# Altium schematic sheet BATTERY_GESTION.SchDoc: DARKYDEN_BATTERY_GESTION (part 3 of 3)
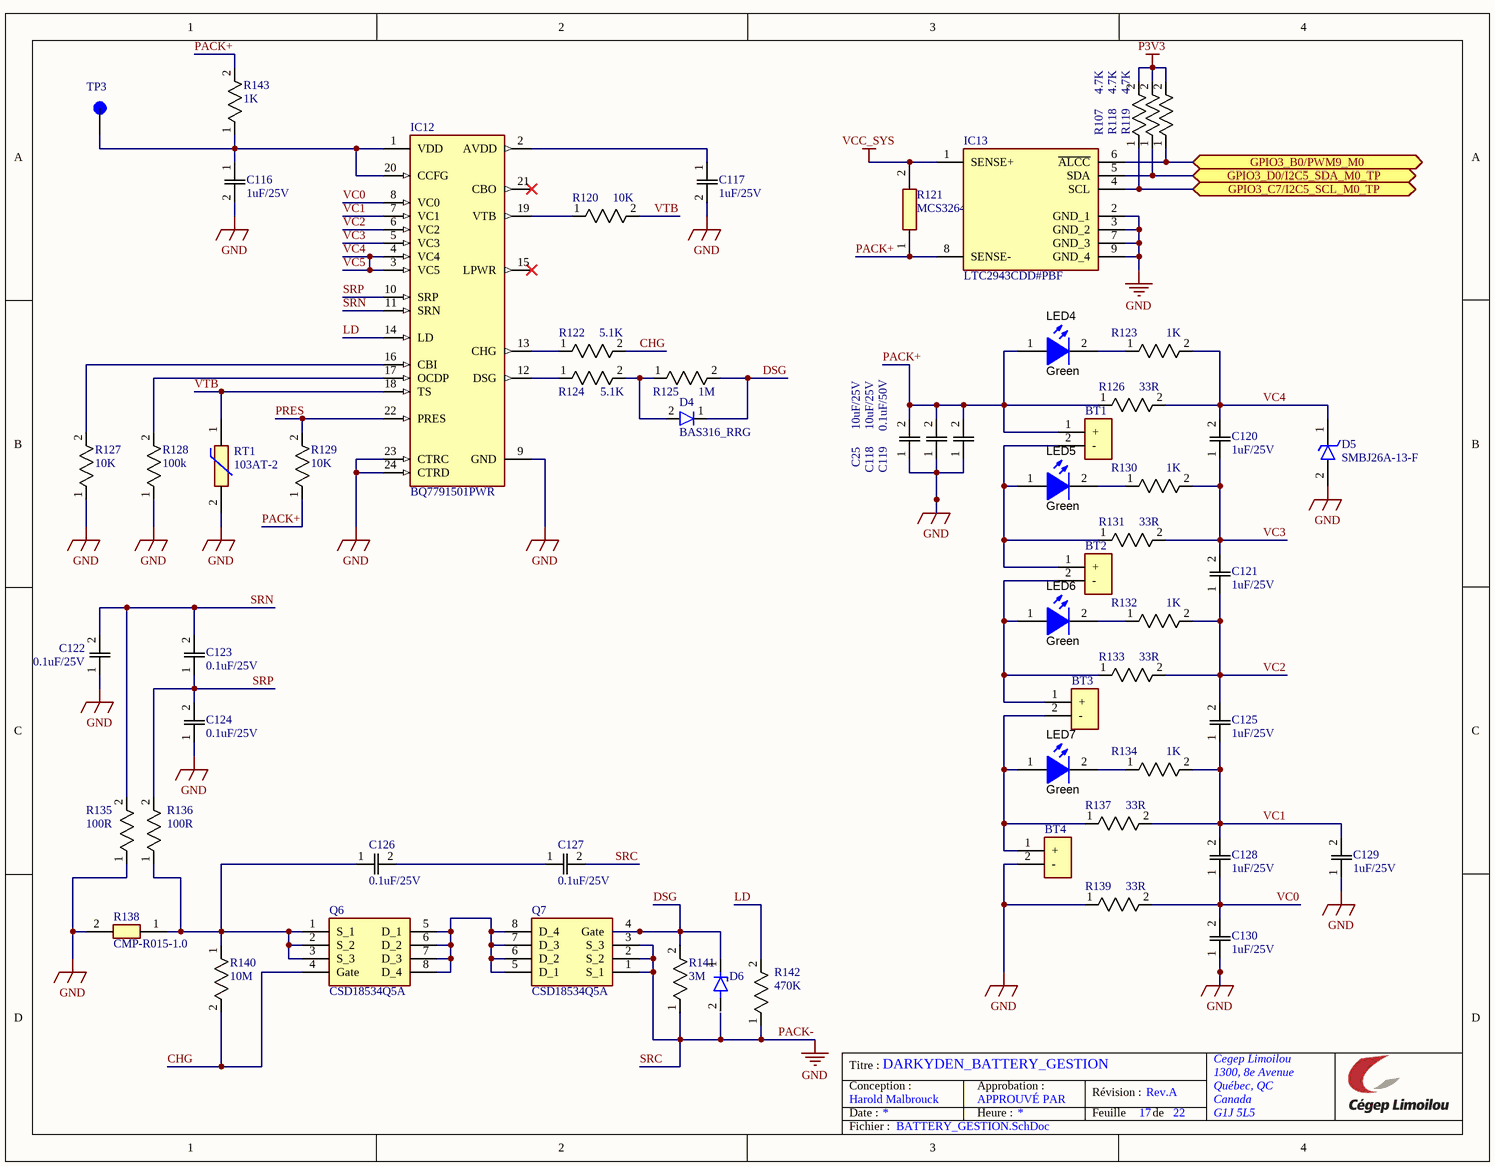
[diagram p2: BATTERY_GESTION.SchDoc]

## Library data of the parts (continued)
R142 = ERJ-3EKF4703V: 470K Ohm 1% 0.1W  Res Thick Film 0603 ±100ppm/°C Molded SMD Punched Carrier T/R; Manufacturer_Name: Panasonic; Voltage Rating: 75V; Value: 470kR; Power Rating: 100mW; Interface: SPI; Max Supply Voltage: 3.6V; Min Supply Voltage: 1.65V; Nominal Supply Current: 15mA; Nominal Supply Voltage (DC): 1.8V; Datasheet Link: http://industrial.panasonic.com/cdbs/www-data/pdf/RDA0000/AOA0000C86.pdf; Height: 0.55mm; Manufacturer_Part_Number: ERJ-3EKF4703V; Mouser Part Number: 667-ERJ-3EKF4703V; Mouser Price/Stock: https://www.mouser.co.uk/ProductDetail/Panasonic/ERJ-3EKF4703V?qs=MVjVSMjNRMpDf0g74YJtlg%3D%3D; Arrow Part Number: ERJ-3EKF4703V; Arrow Price/Stock: https://www.arrow.com/en/products/erj-3ekf4703v/panasonic?utm_currency=USD&region=nac; Supplier: Digikey; Supplier Part Number: P470KHCT-ND; Manufacturer: Panasonic; Manufacturer Part Number: ERJ-3EKF4703V; RoHS: Yes; Category: Chip SMD Resistors; Stock: 160774; Pricing: 1=0.1, 10=0.035, 100=0.0177, 1000=0.01014, 2500=0.00847 (USD); Mounting Technology: Surface Mount; Case/Package: 0603; Case Code (Imperial): 0603; Case Code (Metric): 1608; Contact Plating: Tin; Min Operating Temperature: -55°C; Max Operating Temperature: 155°C; Packaging: Tape and Reel; Tolerance: 1%; Package Quantity: 1; Termination: SMD/SMT; Resistor Type: Thick Film; Number of Terminations: 2; Temperature Coefficient: 100ppm/°C; Max Power Dissipation: 100mW; Voltage Rating (DC): 75V; Features: Automotive AEC-Q200; Series: ERJ; Resistance Tolerance: 1%; Construction: Rectangular; Length: 1.6mm; Width: 0.8mm; Depth: 0.8mm; Radiation Hardening: No; Reach SVHC Compliant: No; Military Standard: Not; Lead Free: Lead Free; RoHS Compliant: Yes; ComponentLink1URL: https://datasheet.ciiva.com/9117/aoa0000ce2-9117093.pdf?src-supplier=Avnet; ComponentLink1Description: https://datasheet.ciiva.com/9117/aoa0000ce2-9117093.pdf?src-supplier=Avnet; ComponentLink2URL: https://datasheet.ciiva.com/9181/aoa0000ce2-9181725.pdf?src-supplier=Avnet; ComponentLink2Description: https://datasheet.ciiva.com/9181/aoa0000ce2-9181725.pdf?src-supplier=Avnet; ComponentLink3URL: https://datasheet.ciiva.com/22687/1678782-22687437.pdf?src-supplier=Element14; ComponentLink3Description: https://datasheet.ciiva.com/22687/1678782-22687437.pdf?src-supplier=Element14; ComponentLink4URL: https://datasheet.ciiva.com/16759/70260748-16759934.pdf?src-supplier=Allied+Electronics; ComponentLink4Description: https://datasheet.ciiva.com/16759/70260748-16759934.pdf?src-supplier=Allied+Electronics; ComponentLink5URL: https://datasheet.ciiva.com/16786/70260748-16786907.pdf?src-supplier=Allied+Electronics; ComponentLink5Description: https://datasheet.ciiva.com/16786/70260748-16786907.pdf?src-supplier=Allied+Electronics; ComponentLink6URL: https://datasheet.ciiva.com/46444/1678782-46444813.pdf?src-supplier=Element14; ComponentLink6Description: https://datasheet.ciiva.com/46444/1678782-46444813.pdf?src-supplier=Element14; ComponentLink7URL: https://datasheet.ciiva.com/46444/1678782-46444814.pdf?src-supplier=Element14; ComponentLink7Description: https://datasheet.ciiva.com/46444/1678782-46444814.pdf?src-supplier=Element14; ComponentLink8URL: https://datasheet.ciiva.com/7836/aoa0000ce2-7836505.pdf?src-supplier=Element14; ComponentLink8Description: https://datasheet.ciiva.com/7836/aoa0000ce2-7836505.pdf?src-supplier=Element14
RT1 = 103AT-2: NTC Thermistor 10k Bead; Manufacturer_Name: Semitec; Datasheet Link: https://www.semitec-global.com/uploads/2022/01/P12-13-AT-Thermistor.pdf; Height: 9.5mm; Manufacturer_Part_Number: 103AT-2; Mouser Part Number: 954-103AT-2; Mouser Price/Stock: https://www.mouser.co.uk/ProductDetail/Semitec/103AT-2?qs=wgO0AD0o1vvcDzsKguD%252Bew%3D%3D
TP3 = 5006: Test Point Compact THM PC .350 L .125 OD Heat Resistant Nylon 46 Black | Keystone Electronics 5006; MF: Keystone Electronics Corp.; SnapEDA_Link: https://www.snapeda.com/parts/5006/Keystone/view-part/?ref=snap; Package: NON STANDARD-1 Keystone; Value: *; MP: 5006; Check_prices: https://www.snapeda.com/parts/5006/Keystone/view-part/?ref=eda